# Altium schematic sheet PWM.SchDoc
size A4
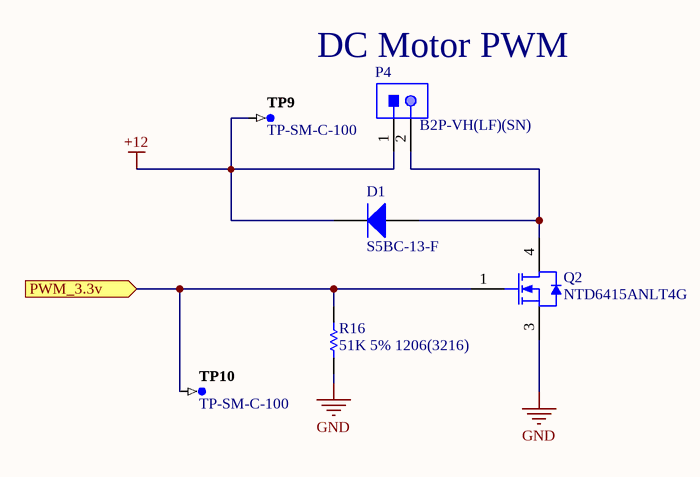
[diagram p0: PWM.SchDoc]

## Parts
D1  S5BC-13-F  [DIOD-S5xC_V]
P4  B2P-VH(LF)(SN)  [JST-B2P-VH(LF)(SN)_V]
Q2  NTD6415ANLT4G  [ONSC-DPAK-3-369AA-01_V]
R16  51K 5% 1206(3216)  [RESC1206(3216)_M]
TP9  TP-SM-C-100  [TP-SM-C-100]  (no BOM)
TP10  TP-SM-C-100  [TP-SM-C-100]  (no BOM)

## Ports
PWM_3.3v (in)

## Nets
+12: D1.2(K) P4.1 TP9.1
GND: Q2.3(S) R16.1
PWM_3.3v: Q2.1(G) R16.2 TP10.1 ; port PWM_3.3v
NetD1_1: D1.1(A) P4.2 Q2.4(D)

## Notes on the sheet
- DC Motor PWM
- CC2511 Assignment2 Group 3
- Date:
- Sheet
- of
- Time:
- Revision:
- Kim Bender, Peng Cheng
- Levi Smith, Fuzhen Liu
- Drawn by:
- File:

## Library data of the parts
D1 = CMP-2000-07025-1: Surface Mount Glass Passivated Rectifier, 5 A, 100 V, -65 to 150 degC, 2-Pin SMC, RoHS, Tape and Reel; Manufacturer: Diodes Inc; Reverse Current-Max: 10µA; Peak Current-Max: 100A; Average Rectified Current-Max: 5A; Reverse Voltage-Max [Vrrm]: 100V; Forward Voltage: 1.15V; Datasheet URL: http://www.diodes.com/_files/datasheets/ds16007.pdf; Package Description: 2-Pin Molded Component, Body 6.855 x 5.905 mm; Manufacturer URL: http://www.diodes.com/; Datasheet Version: Rev. 9-2, 09/2010; Package Reference: S5xC; Mounting Technology: SurfaceMount
P4 = CMP-1755-00002-1: Male Header, Pitch 3.96 mm, 1 x 2 Position, Height 10.9 mm, Tail Length 3.7 mm, -25 to 85 degC, RoHS, Bulk; Capacitance: 27 pF; Type (Capacitors): C0G; Voltage Rating (DC): 50 V; Resistance: 100000000000 Ohm; Tolerance: 5%; ComponentLink2Description: Datasheet; Height: 0.8 mm; Radiation Hardening: No; Pins: 2; Package Quantity: 4000; Max Operating Temperature: 125degC; Width: 0.8 mm; PackageDescription: Male Header, Pitch 3.96 mm, 1 x 2 Position, Height 10.9 mm, Tail Length 3.7 mm; Case/Package: 0603; PackageReference: B2P-VH(LF)(SN); Voltage Rating: 50 V; REACH SVHC: No SVHC; Mount: Surface Mount; Min Operating Temperature: -55degC; Case Code (Metric): 1608; ComponentLink2URL: http://www.jst-mfg.com/product/pdf/eng/eVH.pdf; DatasheetVersion: May-16; RoHSCompliant: True; ComponentLink1Description: Manufacturer URL; Case Code (Imperial): 0603; Length: 1.6 mm; Packaging: Tape and Reel; ComponentLink1URL: http://www.jst.com/home2.html
Q2 = CMP-1058-00352-1: N-Channel Power MOSFET, 100 V, 23 A, 56 mOhm, 3-Pin DPAK, Pb-Free, Tape and Reel; Manufacturer: On Semiconductor; VGS(th) Max (V): 2; ID Max (A): 23; VGS Max (V): 20; Configuration: Single; Coss Typ (pF): 156; Crss Typ (pF): 70; Qrr Typ (nC): 152; Ciss Typ (pF): 1024; Channel Polarity: N Channel; PD Max (W): 83; ComponentLink1URL: http://www.onsemi.com/; Mounting Technology: Surface Mount; ComponentLink2URL: http://www.onsemi.cn/pub_link/Collateral/NTD6415ANL-D.PDF; RoHS: Pb-Free; PackageVersion: Rev. B, 06/2010; Packing: Tape and Reel; PackageReference: DPAK-3-369AA-01; DatasheetVersion: Rev. 1; ComponentLink1Description: Manufacturer URL; Package Type: DPAK-3; PackageDescription: 3-Pin Flange Mount, Body 6.54 x 6.095 mm, Pitch 2.29 mm; ComponentLink3URL: http://www.onsemi.cn/pub_link/Collateral/369AA.PDF; ComponentLink3Description: Package Specification; PartNumber: NTD6415ANLT4G; ComponentLink2Description: Datasheet
R16 = CMP-1014-00115-1: 51K 0.25W 5% 1206 (3216 Metric)  SMD; Case-EIA: 1206; Value: 51000.00 Ohm; Case-Metric: 3216; Technology: SMT; Power: 0.25 W; Tolerance: 5 %
TP9 TP10 = CMP-0484-00002-2: Test Point, Surface Mount, Circular, Pad Diameter 1 mm; Manufacturer: No Vendor; PartNumber: TP-SM-C-100